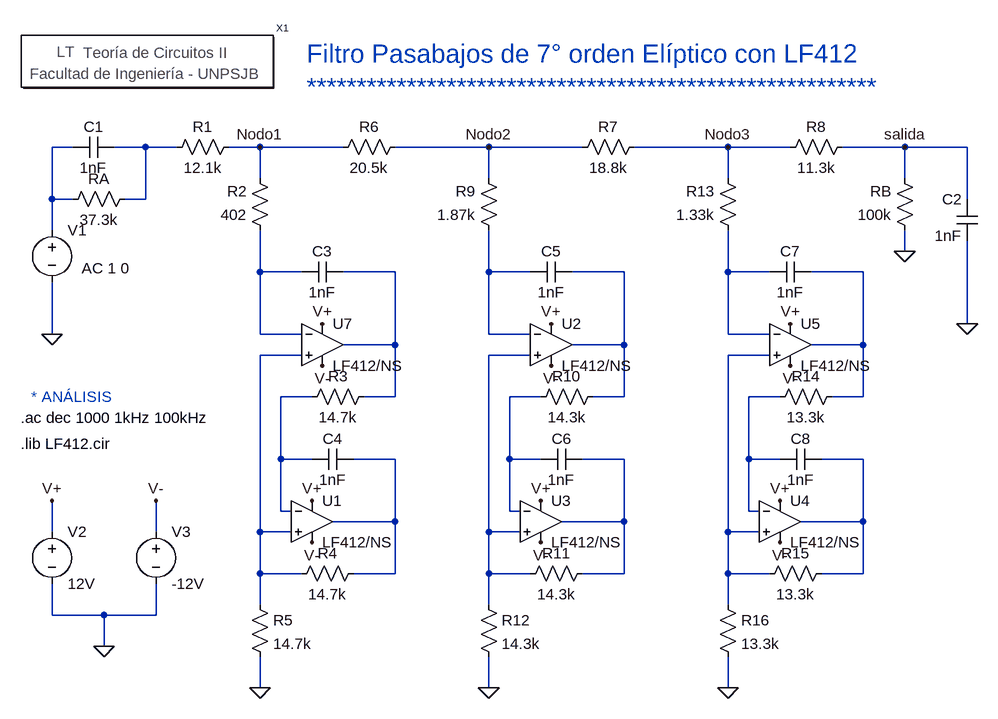
[diagram p0: schematic Filtro eliptico pasabajos de 7 orden con componentes D con operacionales LF 412.asc]
Filtro eliptico pasabajos de 7 orden con componentes D con operacionales LF 412.asc, the LTspice schematic file:
Version 4
SHEET 1 2036 1028
WIRE -2192 -4896 -2224 -4896
WIRE -2080 -4896 -2128 -4896
WIRE -2032 -4896 -2080 -4896
WIRE -1904 -4896 -1952 -4896
WIRE -1776 -4896 -1904 -4896
WIRE -1552 -4896 -1696 -4896
WIRE -1408 -4896 -1552 -4896
WIRE -1184 -4896 -1328 -4896
WIRE -1088 -4896 -1184 -4896
WIRE -912 -4896 -1008 -4896
WIRE -816 -4896 -912 -4896
WIRE -1904 -4848 -1904 -4896
WIRE -1552 -4848 -1552 -4896
WIRE -1184 -4848 -1184 -4896
WIRE -912 -4848 -912 -4896
WIRE -2224 -4816 -2224 -4896
WIRE -2192 -4816 -2224 -4816
WIRE -2080 -4816 -2080 -4896
WIRE -2080 -4816 -2112 -4816
WIRE -816 -4816 -816 -4896
WIRE -2224 -4768 -2224 -4816
WIRE -912 -4736 -912 -4768
WIRE -1904 -4704 -1904 -4768
WIRE -1840 -4704 -1904 -4704
WIRE -1696 -4704 -1776 -4704
WIRE -1552 -4704 -1552 -4768
WIRE -1488 -4704 -1552 -4704
WIRE -1344 -4704 -1424 -4704
WIRE -1184 -4704 -1184 -4768
WIRE -1120 -4704 -1184 -4704
WIRE -976 -4704 -1056 -4704
WIRE -816 -4624 -816 -4752
WIRE -2224 -4608 -2224 -4688
WIRE -1904 -4608 -1904 -4704
WIRE -1840 -4608 -1904 -4608
WIRE -1552 -4608 -1552 -4704
WIRE -1488 -4608 -1552 -4608
WIRE -1184 -4608 -1184 -4704
WIRE -1120 -4608 -1184 -4608
WIRE -1696 -4592 -1696 -4704
WIRE -1696 -4592 -1776 -4592
WIRE -1344 -4592 -1344 -4704
WIRE -1344 -4592 -1424 -4592
WIRE -976 -4592 -976 -4704
WIRE -976 -4592 -1056 -4592
WIRE -1840 -4576 -1904 -4576
WIRE -1488 -4576 -1552 -4576
WIRE -1120 -4576 -1184 -4576
WIRE -1824 -4512 -1872 -4512
WIRE -1696 -4512 -1696 -4592
WIRE -1696 -4512 -1744 -4512
WIRE -1472 -4512 -1520 -4512
WIRE -1344 -4512 -1344 -4592
WIRE -1344 -4512 -1392 -4512
WIRE -1104 -4512 -1152 -4512
WIRE -976 -4512 -976 -4592
WIRE -976 -4512 -1024 -4512
WIRE -1872 -4416 -1872 -4512
WIRE -1824 -4416 -1872 -4416
WIRE -1696 -4416 -1760 -4416
WIRE -1520 -4416 -1520 -4512
WIRE -1472 -4416 -1520 -4416
WIRE -1344 -4416 -1408 -4416
WIRE -1152 -4416 -1152 -4512
WIRE -1104 -4416 -1152 -4416
WIRE -976 -4416 -1040 -4416
WIRE -1872 -4336 -1872 -4416
WIRE -1856 -4336 -1872 -4336
WIRE -1520 -4336 -1520 -4416
WIRE -1504 -4336 -1520 -4336
WIRE -1152 -4336 -1152 -4416
WIRE -1136 -4336 -1152 -4336
WIRE -1696 -4320 -1696 -4416
WIRE -1696 -4320 -1792 -4320
WIRE -1344 -4320 -1344 -4416
WIRE -1344 -4320 -1440 -4320
WIRE -976 -4320 -976 -4416
WIRE -976 -4320 -1072 -4320
WIRE -2224 -4304 -2224 -4352
WIRE -2064 -4304 -2064 -4352
WIRE -1904 -4304 -1904 -4576
WIRE -1856 -4304 -1904 -4304
WIRE -1552 -4304 -1552 -4576
WIRE -1504 -4304 -1552 -4304
WIRE -1184 -4304 -1184 -4576
WIRE -1136 -4304 -1184 -4304
WIRE -1904 -4240 -1904 -4304
WIRE -1840 -4240 -1904 -4240
WIRE -1696 -4240 -1696 -4320
WIRE -1696 -4240 -1760 -4240
WIRE -1552 -4240 -1552 -4304
WIRE -1488 -4240 -1552 -4240
WIRE -1344 -4240 -1344 -4320
WIRE -1344 -4240 -1408 -4240
WIRE -1184 -4240 -1184 -4304
WIRE -1120 -4240 -1184 -4240
WIRE -976 -4240 -976 -4320
WIRE -976 -4240 -1040 -4240
WIRE -1904 -4192 -1904 -4240
WIRE -1552 -4192 -1552 -4240
WIRE -1184 -4192 -1184 -4240
WIRE -2224 -4176 -2224 -4224
WIRE -2144 -4176 -2224 -4176
WIRE -2064 -4176 -2064 -4224
WIRE -2064 -4176 -2144 -4176
WIRE -2144 -4128 -2144 -4176
WIRE -1904 -4064 -1904 -4112
WIRE -1552 -4064 -1552 -4112
WIRE -1184 -4064 -1184 -4112
FLAG -2224 -4608 0
FLAG -816 -4624 0
FLAG -1904 -4064 0
FLAG -1552 -4064 0
FLAG -1184 -4064 0
FLAG -912 -4896 salida
FLAG -1904 -4896 Nodo1
FLAG -1552 -4896 Nodo2
FLAG -1184 -4896 Nodo3
FLAG -2144 -4128 0
FLAG -2224 -4352 V+
FLAG -2064 -4352 V-
FLAG -1808 -4624 V+
FLAG -1808 -4560 V-
FLAG -1824 -4352 V+
FLAG -1824 -4288 V-
FLAG -1456 -4624 V+
FLAG -1456 -4560 V-
FLAG -1472 -4352 V+
FLAG -1472 -4288 V-
FLAG -1104 -4352 V+
FLAG -1104 -4288 V-
FLAG -1088 -4624 V+
FLAG -1088 -4560 V-
FLAG -912 -4736 0
SYMBOL voltage -2224 -4784 R0
WINDOW 123 46 74 Left 2
WINDOW 39 0 0 Left 2
SYMATTR Value2 AC 1 0
SYMATTR InstName V1
SYMATTR Value ""
SYMBOL cap -2128 -4912 R90
WINDOW 0 0 32 VBottom 2
WINDOW 3 32 32 VTop 2
SYMATTR InstName C1
SYMATTR Value 1nF
SYMBOL cap -800 -4752 R180
WINDOW 0 24 64 Left 2
WINDOW 3 24 8 Left 2
SYMATTR InstName C2
SYMATTR Value 1nF
SYMBOL cap -1776 -4720 R90
WINDOW 0 0 32 VBottom 2
WINDOW 3 32 32 VTop 2
SYMATTR InstName C3
SYMATTR Value 1nF
SYMBOL cap -1824 -4400 R270
WINDOW 0 32 32 VTop 2
WINDOW 3 0 32 VBottom 2
SYMATTR InstName C4
SYMATTR Value 1nF
SYMBOL res -1936 -4912 R90
WINDOW 0 0 56 VBottom 2
WINDOW 3 32 56 VTop 2
SYMATTR InstName R1
SYMATTR Value 12.1k
SYMBOL res -1888 -4752 R180
WINDOW 0 36 76 Left 2
WINDOW 3 36 40 Left 2
SYMATTR InstName R2
SYMATTR Value 402
SYMBOL res -1728 -4528 R90
WINDOW 0 0 56 VBottom 2
WINDOW 3 32 56 VTop 2
SYMATTR InstName R3
SYMATTR Value 14.7k
SYMBOL res -1744 -4256 R90
WINDOW 0 0 56 VBottom 2
WINDOW 3 32 56 VTop 2
SYMATTR InstName R4
SYMATTR Value 14.7k
SYMBOL res -1920 -4208 R0
SYMATTR InstName R5
SYMATTR Value 14.7k
SYMBOL res -1680 -4912 R90
WINDOW 0 0 56 VBottom 2
WINDOW 3 32 56 VTop 2
SYMATTR InstName R6
SYMATTR Value 20.5k
SYMBOL res -1312 -4912 R90
WINDOW 0 0 56 VBottom 2
WINDOW 3 32 56 VTop 2
SYMATTR InstName R7
SYMATTR Value 18.8k
SYMBOL res -992 -4912 R90
WINDOW 0 0 56 VBottom 2
WINDOW 3 32 56 VTop 2
SYMATTR InstName R8
SYMATTR Value 11.3k
SYMBOL cap -1424 -4720 R90
WINDOW 0 0 32 VBottom 2
WINDOW 3 32 32 VTop 2
SYMATTR InstName C5
SYMATTR Value 1nF
SYMBOL cap -1472 -4400 R270
WINDOW 0 32 32 VTop 2
WINDOW 3 0 32 VBottom 2
SYMATTR InstName C6
SYMATTR Value 1nF
SYMBOL res -1536 -4752 R180
WINDOW 0 36 76 Left 2
WINDOW 3 36 40 Left 2
SYMATTR InstName R9
SYMATTR Value 1.87k
SYMBOL res -1376 -4528 R90
WINDOW 0 0 56 VBottom 2
WINDOW 3 32 56 VTop 2
SYMATTR InstName R10
SYMATTR Value 14.3k
SYMBOL res -1392 -4256 R90
WINDOW 0 0 56 VBottom 2
WINDOW 3 32 56 VTop 2
SYMATTR InstName R11
SYMATTR Value 14.3k
SYMBOL res -1568 -4208 R0
SYMATTR InstName R12
SYMATTR Value 14.3k
SYMBOL cap -1056 -4720 R90
WINDOW 0 0 32 VBottom 2
WINDOW 3 32 32 VTop 2
SYMATTR InstName C7
SYMATTR Value 1nF
SYMBOL cap -1104 -4400 R270
WINDOW 0 32 32 VTop 2
WINDOW 3 0 32 VBottom 2
SYMATTR InstName C8
SYMATTR Value 1nF
SYMBOL res -1168 -4752 R180
WINDOW 0 36 76 Left 2
WINDOW 3 36 40 Left 2
SYMATTR InstName R13
SYMATTR Value 1.33k
SYMBOL res -1008 -4528 R90
WINDOW 0 0 56 VBottom 2
WINDOW 3 32 56 VTop 2
SYMATTR InstName R14
SYMATTR Value 13.3k
SYMBOL res -1024 -4256 R90
WINDOW 0 0 56 VBottom 2
WINDOW 3 32 56 VTop 2
SYMATTR InstName R15
SYMATTR Value 13.3k
SYMBOL res -1200 -4208 R0
SYMATTR InstName R16
SYMATTR Value 13.3k
SYMBOL Opamps\\opamp2 -1808 -4656 R0
SYMATTR InstName U7
SYMATTR Value LF412/NS
SYMBOL voltage -2224 -4320 R0
SYMATTR InstName V2
SYMATTR Value 12V
SYMBOL voltage -2064 -4320 R0
SYMATTR InstName V3
SYMATTR Value -12V
SYMBOL Opamps\\opamp2 -1824 -4384 R0
SYMATTR InstName U1
SYMATTR Value LF412/NS
SYMBOL Opamps\\opamp2 -1456 -4656 R0
SYMATTR InstName U2
SYMATTR Value LF412/NS
SYMBOL Opamps\\opamp2 -1472 -4384 R0
SYMATTR InstName U3
SYMATTR Value LF412/NS
SYMBOL Opamps\\opamp2 -1104 -4384 R0
SYMATTR InstName U4
SYMATTR Value LF412/NS
SYMBOL Opamps\\opamp2 -1088 -4656 R0
SYMATTR InstName U5
SYMATTR Value LF412/NS
SYMBOL res -2096 -4832 R90
WINDOW 0 0 56 VBottom 2
WINDOW 3 32 56 VTop 2
SYMATTR InstName RA
SYMATTR Value 37.3k
SYMBOL res -896 -4752 R180
WINDOW 0 36 76 Left 2
WINDOW 3 36 40 Left 2
SYMATTR InstName RB
SYMATTR Value 100k
SYMBOL Circuitos2\\Letreros\\Teoría\ de\ Circuitos\ II -2080 -5024 R0
SYMATTR InstName X1
TEXT -1832 -5040 Left 4 ;Filtro Pasabajos de 7° orden Elíptico con LF412\n*********************************************************
TEXT -2272 -4480 Left 2 !.ac dec 1000 1kHz 100kHz
TEXT -2272 -4440 Left 2 !.lib LF412.cir
TEXT -2256 -4512 Left 2 ;* ANÁLISIS

The netlist it stands for:
* Filtro eliptico pasabajos de 7 orden con componentes D con operacionales LF 412.asc
V1 N001 0 AC 1 0
C1 N002 N001 1nF
C2 0 salida 1nF
C3 N004 N003 1nF
C4 N012 N015 1nF
R1 Nodo1 N002 12.1k
R2 N003 Nodo1 402
R3 N004 N012 14.7k
R4 N015 N009 14.7k
R5 N009 0 14.7k
R6 Nodo2 Nodo1 20.5k
R7 Nodo3 Nodo2 18.8k
R8 salida Nodo3 11.3k
C5 N006 N005 1nF
C6 N013 N016 1nF
R9 N005 Nodo2 1.87k
R10 N006 N013 14.3k
R11 N016 N010 14.3k
R12 N010 0 14.3k
C7 N008 N007 1nF
C8 N014 N017 1nF
R13 N007 Nodo3 1.33k
R14 N008 N014 13.3k
R15 N017 N011 13.3k
R16 N011 0 13.3k
XU7 N009 N003 V+ V- N004 LF412/NS  ; pins In+ In- V+ V- OUT
V2 V+ 0 12V
V3 V- 0 -12V
XU1 N009 N012 V+ V- N015 LF412/NS  ; pins In+ In- V+ V- OUT
XU2 N010 N005 V+ V- N006 LF412/NS  ; pins In+ In- V+ V- OUT
XU3 N010 N013 V+ V- N016 LF412/NS  ; pins In+ In- V+ V- OUT
XU4 N011 N014 V+ V- N017 LF412/NS  ; pins In+ In- V+ V- OUT
XU5 N011 N007 V+ V- N008 LF412/NS  ; pins In+ In- V+ V- OUT
RA N002 N001 37.3k
RB 0 salida 100k
XX1 Teoría de Circuitos II
* Filtro Pasabajos de 7° orden Elíptico con LF412
* *********************************************************
.ac dec 1000 1kHz 100kHz
.lib LF412.cir
* * ANÁLISIS
.backanno
.end